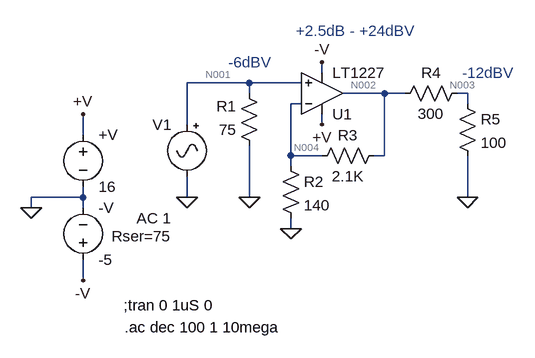
[diagram p0: schematic videoInput.asc]
videoInput.asc, the LTspice schematic file:
Version 4
SHEET 1 880 680
WIRE 256 112 256 96
WIRE 144 128 48 128
WIRE 224 128 144 128
WIRE 144 144 144 128
WIRE 352 144 288 144
WIRE 384 144 352 144
WIRE 480 144 464 144
WIRE 224 160 208 160
WIRE 480 160 480 144
WIRE 48 192 48 128
WIRE 256 192 256 176
WIRE -112 208 -112 176
WIRE 208 240 208 160
WIRE 256 240 208 240
WIRE 352 240 352 144
WIRE 352 240 336 240
WIRE 208 256 208 240
WIRE -112 304 -112 288
WIRE -112 304 -192 304
WIRE 48 304 48 272
WIRE 144 304 144 224
WIRE 480 304 480 240
WIRE -192 320 -192 304
WIRE -112 320 -112 304
WIRE 208 352 208 336
WIRE -112 432 -112 400
FLAG 48 304 0
FLAG 144 304 0
FLAG -192 320 0
FLAG -112 176 +V
FLAG -112 432 -V
FLAG 208 352 0
FLAG 480 304 0
FLAG 256 96 -V
FLAG 256 192 +V
SYMBOL Misc\\signal 48 176 M0
WINDOW 123 24 160 Left 2
WINDOW 39 24 188 Left 2
SYMATTR InstName V1
SYMATTR Value ""
SYMATTR Value2 AC 1
SYMATTR SpiceLine Rser=75
SYMBOL res 160 240 R180
WINDOW 0 36 76 Left 2
WINDOW 3 36 40 Left 2
SYMATTR InstName R1
SYMATTR Value 75
SYMBOL voltage -112 192 R0
SYMATTR InstName +V
SYMATTR Value 16
SYMBOL voltage -112 416 M180
WINDOW 0 24 96 Left 2
WINDOW 3 24 16 Left 2
SYMATTR InstName -V
SYMATTR Value -5
SYMBOL res 192 240 R0
SYMATTR InstName R2
SYMATTR Value 140
SYMBOL res 352 224 R90
WINDOW 0 0 56 VBottom 2
WINDOW 3 32 56 VTop 2
SYMATTR InstName R3
SYMATTR Value 2.1K
SYMBOL res 480 128 R90
WINDOW 0 0 56 VBottom 2
WINDOW 3 32 56 VTop 2
SYMATTR InstName R4
SYMATTR Value 300
SYMBOL res 464 144 R0
SYMATTR InstName R5
SYMATTR Value 100
SYMBOL Opamps\\LT1227 256 208 M180
SYMATTR InstName U1
TEXT -50 470 Left 2 !;tran 0 1uS 0
TEXT -48 504 Left 2 !.ac dec 100 1 10mega
TEXT 472 112 Left 2 ;-12dBV
TEXT 216 48 Left 2 ;+2.5dB - +24dBV
TEXT 112 96 Left 2 ;-6dBV

The netlist it stands for:
* videoInput.asc
V1 N001 0 AC 1 Rser=75
R1 0 N001 75
V§+V +V 0 16
V§-V -V 0 -5
R2 N004 0 140
R3 N002 N004 2.1K
R4 N003 N002 300
R5 N003 0 100
XU1 N001 N004 +V -V N002 LT1227  ; pins In+ In- V+ V- OUT
;tran 0 1uS 0
.ac dec 100 1 10mega
* -12dBV
* +2.5dB - +24dBV
* -6dBV
.backanno
.end

* Results of the author's LTspice run, read from the files saved beside the schematic
* Operating Point, zero values left out:
*   V(n001) = 55.86 µV
*   V(+v) = 16 V
*   V(-v) = -5 V
*   V(n004) = 3.484 mV
*   V(n002) = 33.65 mV
*   V(n003) = 8.412 mV
*   I(R5) = 84.12 µA
*   I(R4) = -84.12 µA
*   I(R3) = 14.36 µA
*   I(R2) = 24.88 µA
*   I(R1) = -744.9 nA
*   I(-v) = 9.235 mA
*   I(+v) = -9.345 mA
*   I(V1) = 744.9 nA
*   Ix(u1:3) = -1.49 µA
*   Ix(u1:2) = -10.52 µA
*   Ix(u1:7) = 9.345 mA
*   Ix(u1:4) = -9.235 mA
*   Ix(u1:6) = -98.49 µA
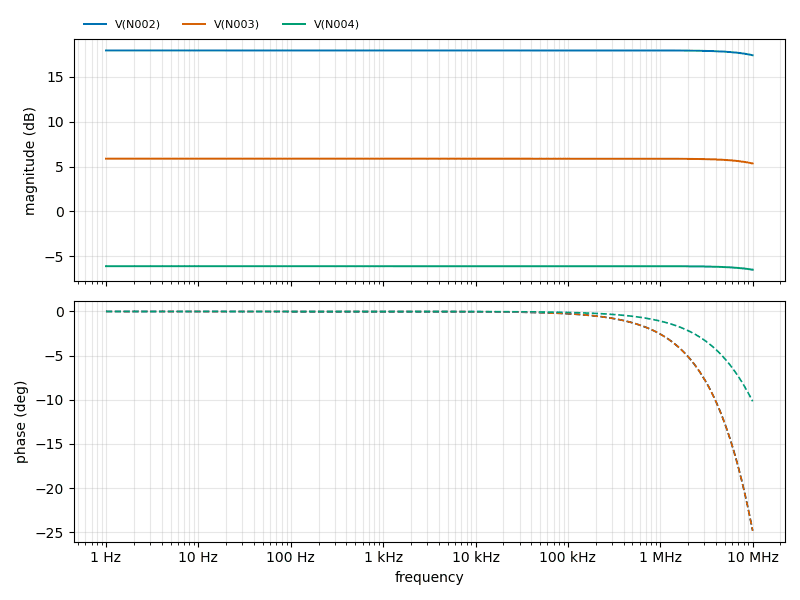
[diagram p1: AC Analysis of videoInput.asc, plotted from the saved traces]
* AC Analysis, 1 run:
*   V(N002): 17.92 dB at 1 Hz, 17.38 dB at 10 MHz, peak 17.92 dB at 1 Hz
*   V(N003): 5.88 dB at 1 Hz, 5.34 dB at 10 MHz, peak 5.88 dB at 1 Hz
*   V(N004): -6.08 dB at 1 Hz, -6.48 dB at 10 MHz, peak -6.08 dB at 1 Hz